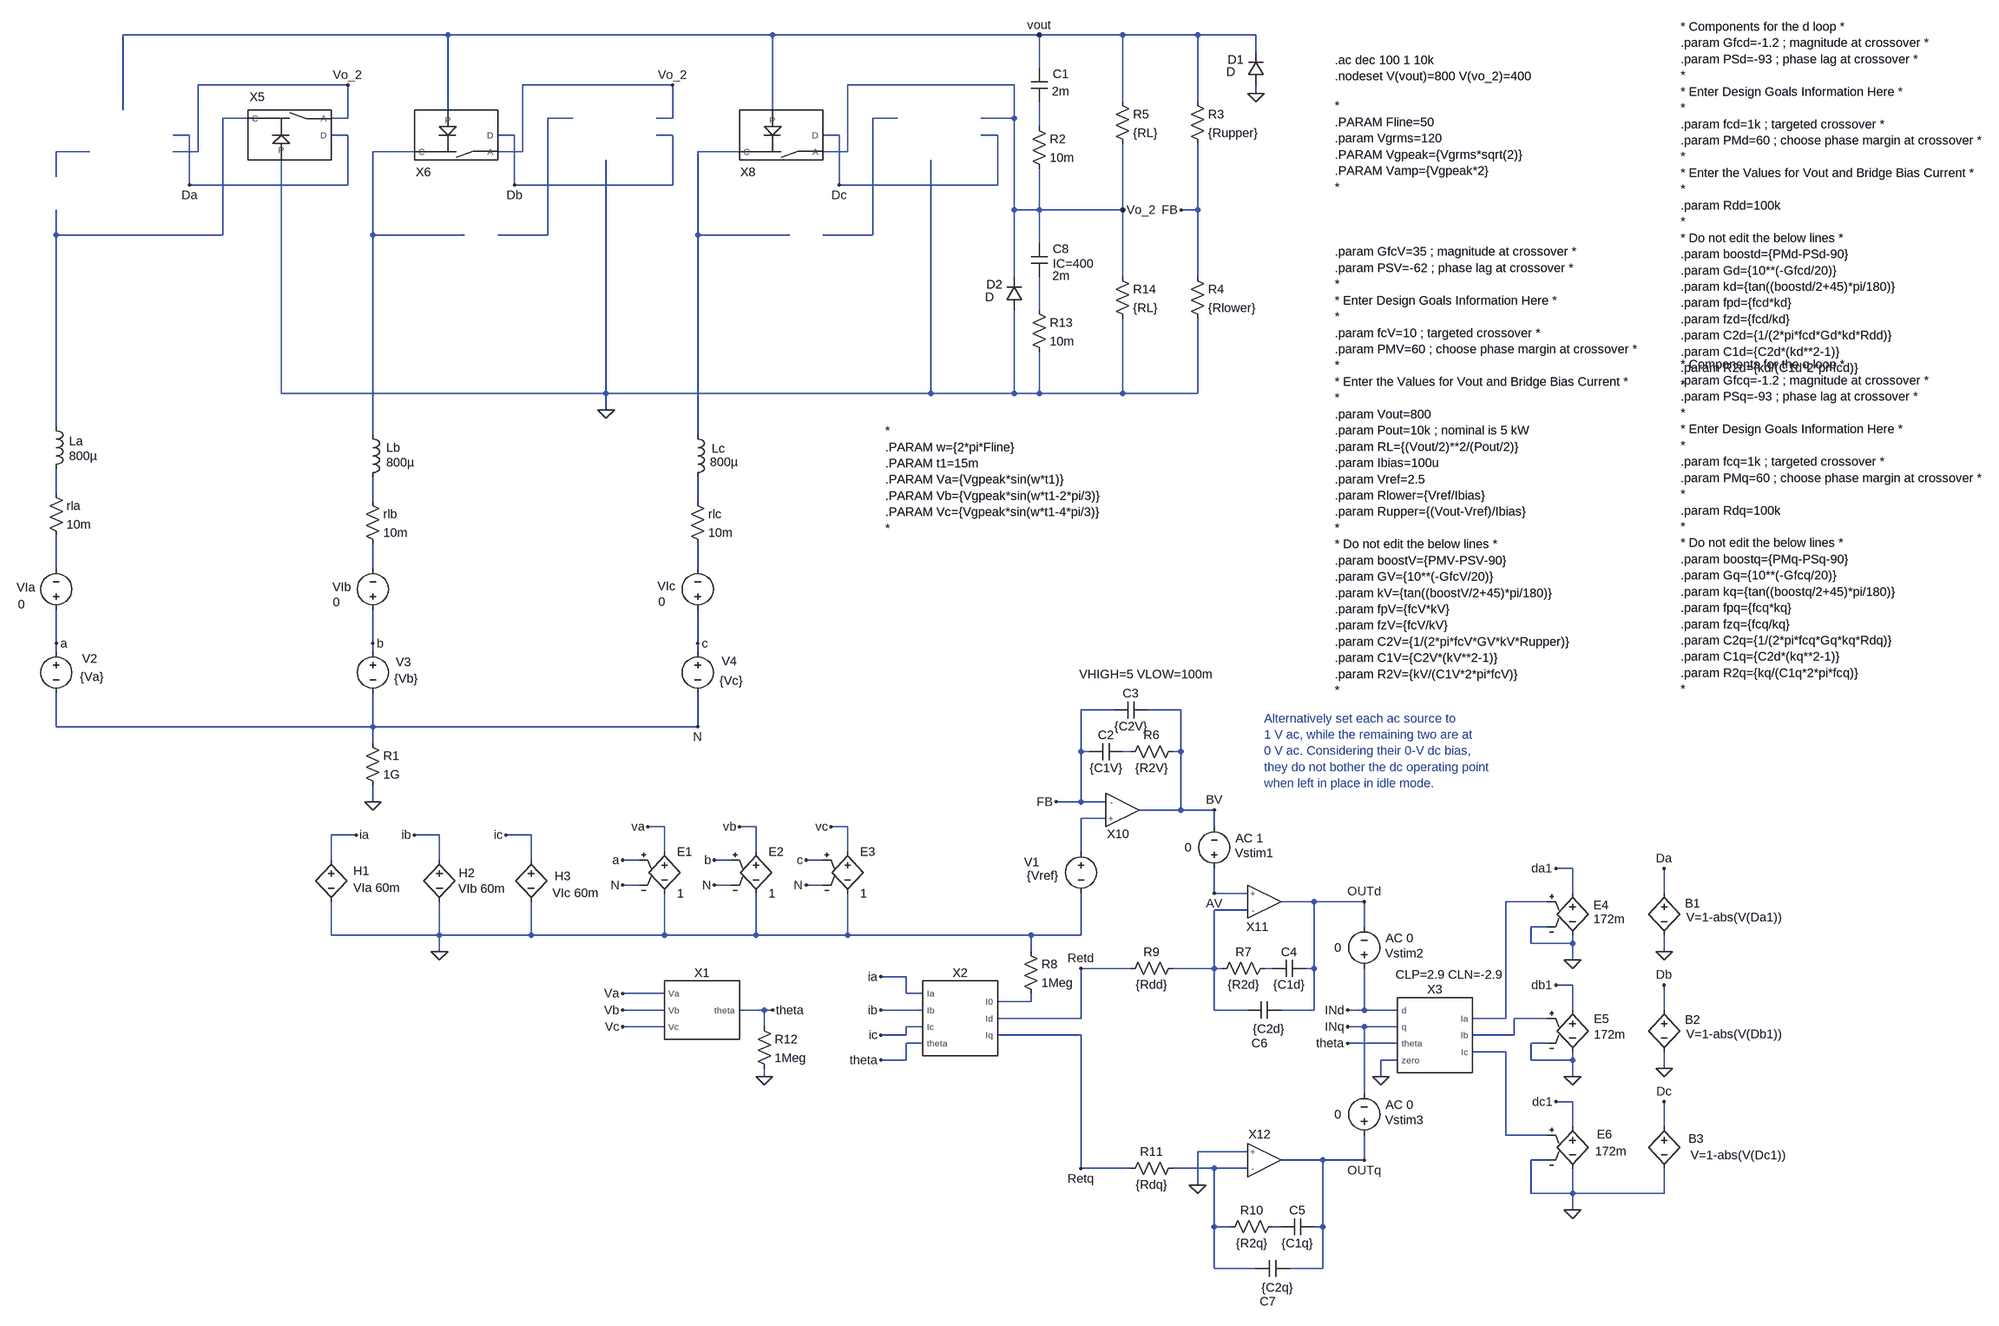
[diagram p0: schematic 3-phase Vienna PFC averaged model - ac response.asc]
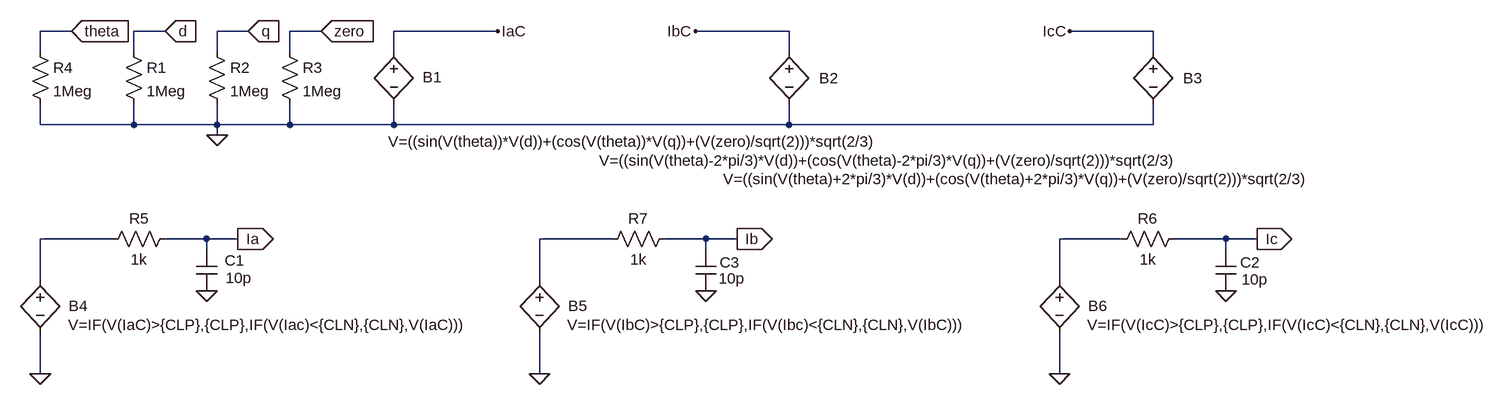
[diagram p1: sub-circuit inverse_dq0.asc]
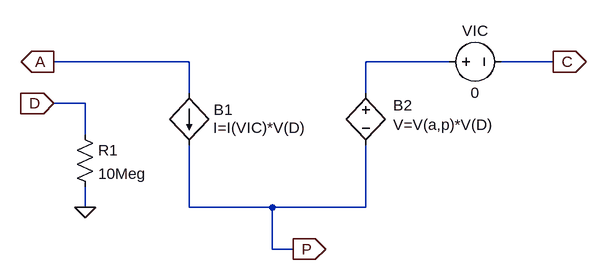
[diagram p2: sub-circuit pwmvm.asc]
3-phase Vienna PFC averaged model - ac response.asc, the LTspice schematic file:
Version 4.1
SHEET 1 4316 1596
WIRE 256 -992 -368 -992
WIRE 880 -992 256 -992
WIRE 1392 -992 880 -992
WIRE 1552 -992 1392 -992
WIRE 1696 -992 1552 -992
WIRE 1808 -992 1696 -992
WIRE 1808 -960 1808 -992
WIRE 1392 -928 1392 -992
WIRE 64 -896 -224 -896
WIRE 688 -896 400 -896
WIRE 1344 -896 1024 -896
WIRE 1808 -880 1808 -896
WIRE 1552 -864 1552 -992
WIRE 1696 -864 1696 -992
WIRE -368 -848 -368 -992
WIRE 256 -848 256 -992
WIRE 880 -848 880 -992
WIRE -128 -832 -176 -832
WIRE 64 -832 64 -896
WIRE 64 -832 32 -832
WIRE 496 -832 448 -832
WIRE 688 -832 688 -896
WIRE 688 -832 656 -832
WIRE 1120 -832 1072 -832
WIRE 1344 -832 1344 -896
WIRE 1344 -832 1280 -832
WIRE 1392 -816 1392 -864
WIRE -240 -800 -272 -800
WIRE 64 -800 32 -800
WIRE 384 -800 352 -800
WIRE 688 -800 656 -800
WIRE 1008 -800 976 -800
WIRE 1312 -800 1280 -800
WIRE -432 -768 -496 -768
WIRE -224 -768 -224 -896
WIRE -224 -768 -272 -768
WIRE 192 -768 112 -768
WIRE 400 -768 400 -896
WIRE 400 -768 352 -768
WIRE 816 -768 736 -768
WIRE 1024 -768 1024 -896
WIRE 1024 -768 976 -768
WIRE -496 -720 -496 -768
WIRE -240 -704 -240 -800
WIRE 64 -704 64 -800
WIRE 64 -704 -240 -704
WIRE 384 -704 384 -800
WIRE 688 -704 688 -800
WIRE 688 -704 384 -704
WIRE 1008 -704 1008 -800
WIRE 1312 -704 1312 -800
WIRE 1312 -704 1008 -704
WIRE 1344 -656 1344 -832
WIRE 1392 -656 1392 -736
WIRE 1392 -656 1344 -656
WIRE 1552 -656 1552 -784
WIRE 1552 -656 1392 -656
WIRE 1696 -656 1696 -784
WIRE 1696 -656 1664 -656
WIRE -496 -608 -496 -656
WIRE -176 -608 -176 -832
WIRE -176 -608 -496 -608
WIRE 112 -608 112 -768
WIRE 288 -608 112 -608
WIRE 448 -608 448 -832
WIRE 448 -608 352 -608
WIRE 736 -608 736 -768
WIRE 912 -608 736 -608
WIRE 1072 -608 1072 -832
WIRE 1072 -608 976 -608
WIRE 1392 -592 1392 -656
WIRE 1344 -528 1344 -656
WIRE 1552 -528 1552 -656
WIRE 1696 -528 1696 -656
WIRE 1392 -464 1392 -528
WIRE -64 -304 -64 -752
WIRE 560 -304 560 -752
WIRE 560 -304 -64 -304
WIRE 1184 -304 1184 -752
WIRE 1184 -304 560 -304
WIRE 1344 -304 1344 -464
WIRE 1344 -304 1184 -304
WIRE 1392 -304 1392 -384
WIRE 1392 -304 1344 -304
WIRE 1552 -304 1552 -448
WIRE 1552 -304 1392 -304
WIRE 1696 -304 1696 -448
WIRE 1696 -304 1552 -304
WIRE 560 -272 560 -304
WIRE -496 -240 -496 -608
WIRE 112 -224 112 -608
WIRE 736 -224 736 -608
WIRE -496 -112 -496 -160
WIRE 112 -96 112 -144
WIRE 736 -96 736 -144
WIRE -496 32 -496 -32
WIRE 112 32 112 -16
WIRE 736 32 736 -16
WIRE -496 176 -496 112
WIRE 112 176 112 112
WIRE 736 176 736 112
WIRE -496 192 -496 176
WIRE 112 192 112 176
WIRE 736 192 736 176
WIRE 1536 304 1472 304
WIRE 1664 304 1600 304
WIRE -496 336 -496 272
WIRE 112 336 112 272
WIRE 112 336 -496 336
WIRE 736 336 736 272
WIRE 736 336 112 336
WIRE 112 368 112 336
WIRE 1472 384 1472 304
WIRE 1488 384 1472 384
WIRE 1568 384 1552 384
WIRE 1664 384 1664 304
WIRE 1664 384 1648 384
WIRE 112 480 112 448
WIRE 1472 480 1472 384
WIRE 1472 480 1424 480
WIRE 1520 480 1472 480
WIRE 1664 496 1664 384
WIRE 1664 496 1584 496
WIRE 1728 496 1664 496
WIRE 1520 512 1472 512
WIRE 672 528 640 528
WIRE 848 528 816 528
WIRE 1024 528 992 528
WIRE 1728 528 1728 496
WIRE 80 544 32 544
WIRE 240 544 192 544
WIRE 416 544 368 544
WIRE 672 576 672 528
WIRE 848 576 848 528
WIRE 1024 576 1024 528
WIRE 1472 576 1472 512
WIRE 32 592 32 544
WIRE 240 592 240 544
WIRE 416 592 416 544
WIRE 624 592 592 592
WIRE 800 592 768 592
WIRE 976 592 944 592
WIRE 2416 608 2384 608
WIRE 624 640 592 640
WIRE 800 640 768 640
WIRE 976 640 944 640
WIRE 1728 656 1728 608
WIRE 1792 656 1728 656
WIRE 2416 656 2416 608
WIRE 2592 656 2592 608
WIRE 1920 672 1856 672
WIRE 2016 672 1920 672
WIRE 2368 672 2288 672
WIRE 1792 688 1728 688
WIRE 2016 720 2016 672
WIRE 2368 720 2336 720
WIRE 32 736 32 672
WIRE 240 736 240 672
WIRE 240 736 32 736
WIRE 416 736 416 672
WIRE 416 736 240 736
WIRE 672 736 672 656
WIRE 672 736 416 736
WIRE 848 736 848 656
WIRE 848 736 672 736
WIRE 1024 736 1024 656
WIRE 1024 736 848 736
WIRE 1376 736 1024 736
WIRE 1472 736 1472 656
WIRE 1472 736 1376 736
WIRE 2336 752 2336 720
WIRE 2416 752 2416 736
WIRE 2416 752 2336 752
WIRE 240 768 240 736
WIRE 1376 768 1376 736
WIRE 2592 768 2592 736
WIRE 2416 784 2416 752
WIRE 1568 800 1472 800
WIRE 1728 800 1728 688
WIRE 1728 800 1648 800
WIRE 1744 800 1728 800
WIRE 1840 800 1824 800
WIRE 1920 800 1920 672
WIRE 1920 800 1904 800
WIRE 1136 816 1088 816
WIRE 2416 832 2384 832
WIRE 672 848 592 848
WIRE 1136 848 1136 816
WIRE 1168 848 1136 848
WIRE 1376 864 1376 848
WIRE 1376 864 1312 864
WIRE 672 880 592 880
WIRE 864 880 816 880
WIRE 880 880 864 880
WIRE 1168 880 1088 880
WIRE 1728 880 1728 800
WIRE 1792 880 1728 880
WIRE 1920 880 1920 800
WIRE 1920 880 1856 880
WIRE 2016 880 2016 800
WIRE 2016 880 1984 880
WIRE 2080 880 2016 880
WIRE 2416 880 2416 832
WIRE 2592 880 2592 832
WIRE 1472 896 1472 800
WIRE 1472 896 1312 896
WIRE 2288 896 2288 672
WIRE 2288 896 2224 896
WIRE 2368 896 2304 896
WIRE 672 912 592 912
WIRE 864 912 864 880
WIRE 1168 912 1136 912
WIRE 2016 912 1984 912
WIRE 2080 912 2016 912
WIRE 1136 928 1136 912
WIRE 1136 928 1088 928
WIRE 1472 928 1312 928
WIRE 2304 928 2304 896
WIRE 2304 928 2224 928
WIRE 1168 944 1136 944
WIRE 2080 944 1984 944
WIRE 2368 944 2336 944
WIRE 2288 960 2224 960
WIRE 1136 976 1136 944
WIRE 1136 976 1088 976
WIRE 2080 976 2048 976
WIRE 2336 976 2336 944
WIRE 2416 976 2416 960
WIRE 2416 976 2336 976
WIRE 2592 992 2592 960
WIRE 864 1008 864 992
WIRE 2048 1008 2048 976
WIRE 2416 1008 2416 976
WIRE 2016 1040 2016 912
WIRE 2416 1056 2384 1056
WIRE 2416 1104 2416 1056
WIRE 2592 1104 2592 1056
WIRE 2288 1120 2288 960
WIRE 2368 1120 2288 1120
WIRE 1792 1152 1696 1152
WIRE 1936 1168 1856 1168
WIRE 2016 1168 2016 1120
WIRE 2016 1168 1936 1168
WIRE 2368 1168 2336 1168
WIRE 1472 1184 1472 928
WIRE 1568 1184 1472 1184
WIRE 1728 1184 1648 1184
WIRE 1792 1184 1728 1184
WIRE 1696 1216 1696 1152
WIRE 2336 1232 2336 1168
WIRE 2416 1232 2416 1184
WIRE 2416 1232 2336 1232
WIRE 2592 1232 2592 1184
WIRE 2592 1232 2416 1232
WIRE 2416 1264 2416 1232
WIRE 1728 1296 1728 1184
WIRE 1760 1296 1728 1296
WIRE 1856 1296 1840 1296
WIRE 1936 1296 1936 1168
WIRE 1936 1296 1920 1296
WIRE 1728 1376 1728 1296
WIRE 1808 1376 1728 1376
WIRE 1936 1376 1936 1296
WIRE 1936 1376 1872 1376
FLAG 112 480 0
FLAG 80 544 ia
FLAG 192 544 ib
FLAG 368 544 ic
FLAG -496 176 a
FLAG 112 176 b
FLAG 736 176 c
FLAG 240 768 0
FLAG 640 528 va
FLAG 736 336 N
FLAG 592 640 N
FLAG 592 592 a
FLAG 816 528 vb
FLAG 768 640 N
FLAG 768 592 b
FLAG 992 528 vc
FLAG 944 640 N
FLAG 944 592 c
FLAG 880 880 theta
FLAG 592 848 Va
FLAG 592 880 Vb
FLAG 592 912 Vc
FLAG 1088 816 ia
FLAG 1088 880 ib
FLAG 1088 928 ic
FLAG 1088 976 theta
FLAG 1424 480 FB
FLAG 1696 1216 0
FLAG 1984 944 theta
FLAG 2048 1008 0
FLAG 864 1008 0
FLAG 2384 608 da1
FLAG 2416 784 0
FLAG 2384 832 db1
FLAG 2416 1008 0
FLAG 2384 1056 dc1
FLAG 2416 1264 0
FLAG -240 -704 Da
FLAG 1664 -656 FB
FLAG 1552 -656 Vo_2
FLAG 64 -896 Vo_2
FLAG 384 -704 Db
FLAG 688 -896 Vo_2
FLAG 1008 -704 Dc
FLAG 1808 -880 0
FLAG 2592 768 0
FLAG 2592 992 0
FLAG 2592 608 Da
FLAG 2592 832 Db
FLAG 2592 1056 Dc
FLAG 560 -272 0
FLAG 1392 -992 vout
FLAG 1472 800 Retd
FLAG 1472 1184 Retq
FLAG 1728 496 BV
FLAG 1728 656 AV
FLAG 2016 672 OUTd
FLAG 2016 1168 OUTq
FLAG 1984 880 INd
FLAG 1984 912 INq
DATAFLAG 1120 -992 ""
DATAFLAG 1424 -656 ""
DATAFLAG 1664 448 ""
DATAFLAG 1920 672 ""
DATAFLAG 1920 1168 ""
DATAFLAG 1440 480 ""
DATAFLAG 656 528 ""
DATAFLAG 832 528 ""
DATAFLAG 1008 528 ""
DATAFLAG -464 -608 ""
DATAFLAG 128 -768 ""
DATAFLAG 768 -768 ""
DATAFLAG -144 -704 ""
DATAFLAG 512 -704 ""
DATAFLAG 1120 -704 ""
DATAFLAG 1472 960 ""
DATAFLAG 1520 800 ""
DATAFLAG 848 880 ""
DATAFLAG 1104 816 ""
DATAFLAG 1104 880 ""
DATAFLAG 1120 976 ""
DATAFLAG 1104 928 ""
SYMBOL res 96 352 R0
SYMATTR InstName R1
SYMATTR Value 1G
SYMBOL res -512 -128 R0
SYMATTR InstName rla
SYMATTR Value 10m
SYMBOL res 96 -112 R0
SYMATTR InstName rlb
SYMATTR Value 10m
SYMBOL res 720 -112 R0
SYMATTR InstName rlc
SYMATTR Value 10m
SYMBOL h 32 576 R0
WINDOW 0 43 37 Left 2
WINDOW 3 43 69 Left 2
SYMATTR InstName H1
SYMATTR Value VIa 60m
SYMBOL h 240 576 R0
WINDOW 0 37 41 Left 2
WINDOW 3 36 71 Left 2
SYMATTR InstName H2
SYMATTR Value VIb 60m
SYMBOL h 416 576 R0
WINDOW 0 45 47 Left 2
WINDOW 3 41 79 Left 2
SYMATTR InstName H3
SYMATTR Value VIc 60m
SYMBOL ind -512 -256 R0
WINDOW 0 41 44 Left 2
WINDOW 3 41 72 Left 2
WINDOW 123 41 100 Left 2
SYMATTR InstName La
SYMATTR Value 800µ
SYMBOL ind 96 -240 R0
WINDOW 0 42 40 Left 2
WINDOW 3 42 69 Left 2
WINDOW 123 42 98 Left 2
SYMATTR InstName Lb
SYMATTR Value 800µ
SYMBOL ind 720 -240 R0
WINDOW 0 43 42 Left 2
WINDOW 3 40 68 Left 2
WINDOW 123 39 96 Left 2
SYMATTR InstName Lc
SYMATTR Value 800µ
SYMBOL voltage -496 128 R180
WINDOW 0 40 59 Left 2
WINDOW 3 60 27 Left 2
WINDOW 123 0 0 Left 0
WINDOW 39 0 0 Left 0
SYMATTR InstName VIa
SYMATTR Value 0
SYMBOL voltage 112 128 R180
WINDOW 0 41 60 Left 2
WINDOW 3 63 31 Left 2
WINDOW 123 0 0 Left 0
WINDOW 39 0 0 Left 0
SYMATTR InstName VIb
SYMATTR Value 0
SYMBOL voltage 736 128 R180
WINDOW 0 43 62 Left 2
WINDOW 3 62 32 Left 2
WINDOW 123 0 0 Left 0
WINDOW 39 0 0 Left 0
SYMATTR InstName VIc
SYMATTR Value 0
SYMBOL e 672 560 R0
SYMATTR InstName E1
SYMATTR Value 1
SYMBOL e 848 560 R0
SYMATTR InstName E2
SYMATTR Value 1
SYMBOL e 1024 560 R0
SYMATTR InstName E3
SYMATTR Value 1
SYMBOL theta_sub 736 880 R0
SYMATTR InstName X1
SYMBOL dq0_sub 1232 896 R0
SYMATTR InstName X2
SYMBOL res 1664 368 R90
WINDOW 0 0 56 VBottom 2
WINDOW 3 32 56 VTop 2
SYMATTR InstName R6
SYMATTR Value {R2V}
SYMBOL cap 1552 368 R90
WINDOW 0 0 32 VBottom 2
WINDOW 3 32 32 VTop 2
WINDOW 123 60 32 VTop 2
SYMATTR InstName C2
SYMATTR Value {C1V}
SYMBOL cap 1600 288 R90
WINDOW 0 0 32 VBottom 2
WINDOW 3 32 32 VTop 2
SYMATTR InstName C3
SYMATTR Value {C2V}
SYMBOL res 1728 816 R270
WINDOW 0 32 56 VTop 2
WINDOW 3 0 56 VBottom 2
SYMATTR InstName R7
SYMATTR Value {R2d}
SYMBOL cap 1840 816 R270
WINDOW 0 32 32 VTop 2
WINDOW 3 0 32 VBottom 2
SYMATTR InstName C4
SYMATTR Value {C1d}
SYMBOL cap 1792 896 R270
WINDOW 0 -63 23 VTop 2
WINDOW 3 -5 41 VBottom 2
SYMATTR InstName C6
SYMATTR Value {C2d}
SYMBOL res 1360 752 R0
SYMATTR InstName R8
SYMATTR Value 1Meg
SYMBOL res 1664 784 R90
WINDOW 0 0 56 VBottom 2
WINDOW 3 32 56 VTop 2
SYMATTR InstName R9
SYMATTR Value {Rdd}
SYMBOL res 1744 1312 R270
WINDOW 0 32 56 VTop 2
WINDOW 3 0 56 VBottom 2
SYMATTR InstName R10
SYMATTR Value {R2q}
SYMBOL cap 1856 1312 R270
WINDOW 0 32 32 VTop 2
WINDOW 3 0 32 VBottom 2
SYMATTR InstName C5
SYMATTR Value {C1q}
SYMBOL cap 1808 1392 R270
WINDOW 0 -63 23 VTop 2
WINDOW 3 -5 41 VBottom 2
SYMATTR InstName C7
SYMATTR Value {C2q}
SYMBOL res 1664 1168 R90
WINDOW 0 0 56 VBottom 2
WINDOW 3 32 56 VTop 2
SYMATTR InstName R11
SYMATTR Value {Rdq}
SYMBOL Inverse_dq0 2144 928 R0
WINDOW 39 35 -100 Bottom 2
SYMATTR SpiceLine CLP=2.9 CLN=-2.9
SYMATTR InstName X3
SYMBOL res 848 896 R0
SYMATTR InstName R12
SYMATTR Value 1Meg
SYMBOL opampTOF 1584 480 R0
WINDOW 0 -40 78 Bottom 2
WINDOW 39 13 -229 Bottom 2
SYMATTR InstName X10
SYMATTR SpiceLine VHIGH=5 VLOW=100m
SYMBOL opampTOF 1856 688 M180
WINDOW 0 -45 -17 Bottom 2
SYMATTR InstName X11
SYMATTR SpiceLine VHIGH=5 VLOW=-5
SYMBOL opampTOF 1856 1184 M180
WINDOW 0 -41 81 Bottom 2
SYMATTR InstName X12
SYMATTR SpiceLine VHIGH=5 VLOW=-5
SYMBOL e 2416 640 R0
WINDOW 0 40 39 Left 2
WINDOW 3 40 65 Left 2
SYMATTR InstName E4
SYMATTR Value 172m
SYMBOL e 2416 864 R0
WINDOW 0 41 33 Left 2
WINDOW 3 41 63 Left 2
SYMATTR InstName E5
SYMATTR Value 172m
SYMBOL e 2416 1088 R0
WINDOW 0 47 31 Left 2
WINDOW 3 44 63 Left 2
SYMATTR InstName E6
SYMATTR Value 172m
SYMBOL diode 1824 -896 R180
WINDOW 0 39 49 Left 2
WINDOW 3 55 25 Left 2
SYMATTR InstName D1
SYMBOL cap 1376 -928 R0
WINDOW 0 42 11 Left 2
WINDOW 3 40 44 Left 2
WINDOW 123 42 70 Left 2
SYMATTR InstName C1
SYMATTR Value 2m
SYMBOL res 1376 -832 R0
SYMATTR InstName R2
SYMATTR Value 10m
SYMBOL res 1680 -880 R0
SYMATTR InstName R3
SYMATTR Value {Rupper}
SYMBOL res 1680 -544 R0
SYMATTR InstName R4
SYMATTR Value {Rlower}
SYMBOL res 1536 -880 R0
SYMATTR InstName R5
SYMATTR Value {RL}
SYMBOL cap 1376 -592 R0
WINDOW 0 42 11 Left 2
WINDOW 3 41 62 Left 2
WINDOW 123 42 39 Left 2
SYMATTR InstName C8
SYMATTR Value 2m
SYMATTR Value2 IC=400
SYMBOL res 1376 -480 R0
SYMATTR InstName R13
SYMATTR Value 10m
SYMBOL res 1536 -544 R0
SYMATTR InstName R14
SYMATTR Value {RL}
SYMBOL PWMVM -32 -816 M0
WINDOW 0 78 -41 Bottom 2
SYMATTR InstName X5
SYMBOL PWMVM 288 -784 R180
WINDOW 0 79 -40 Bottom 2
SYMATTR InstName X6
SYMBOL PWMVM 912 -784 R180
WINDOW 0 79 -40 Bottom 2
SYMATTR InstName X8
SYMBOL bv 2592 640 R0
WINDOW 0 40 35 Left 2
WINDOW 3 43 62 Left 2
SYMATTR InstName B1
SYMATTR Value V=1-abs(V(Da1))
SYMBOL bv 2592 864 R0
WINDOW 0 40 35 Left 2
WINDOW 3 43 62 Left 2
SYMATTR InstName B2
SYMATTR Value V=1-abs(V(Db1))
SYMBOL bv 2592 1088 R0
WINDOW 0 47 39 Left 2
WINDOW 3 51 71 Left 2
SYMATTR InstName B3
SYMATTR Value V=1-abs(V(Dc1))
SYMBOL voltage 1472 560 M0
WINDOW 0 80 36 Left 2
WINDOW 3 43 62 Left 2
WINDOW 123 0 0 Left 0
WINDOW 39 0 0 Left 0
SYMATTR InstName V1
SYMATTR Value {Vref}
SYMBOL voltage -496 176 R0
WINDOW 0 50 29 Left 2
WINDOW 3 46 64 Left 2
SYMATTR InstName V2
SYMATTR Value {Va}
SYMBOL voltage 112 176 R0
WINDOW 0 44 36 Left 2
WINDOW 3 41 68 Left 2
SYMATTR InstName V3
SYMATTR Value {Vb}
SYMBOL voltage 736 176 R0
WINDOW 0 46 34 Left 2
WINDOW 3 42 72 Left 2
SYMATTR InstName V4
SYMATTR Value {Vc}
SYMBOL voltage 1728 624 M180
WINDOW 0 40 45 Left 2
WINDOW 3 -57 56 Left 2
WINDOW 123 41 74 Left 2
WINDOW 39 0 0 Left 0
SYMATTR InstName Vstim1
SYMATTR Value 0
SYMATTR Value2 AC 1
SYMBOL diode 1360 -464 R180
WINDOW 0 39 49 Left 2
WINDOW 3 55 25 Left 2
SYMATTR InstName D2
SYMBOL voltage 2016 816 M180
WINDOW 0 40 45 Left 2
WINDOW 3 -57 56 Left 2
WINDOW 123 41 74 Left 2
WINDOW 39 0 0 Left 0
SYMATTR InstName Vstim2
SYMATTR Value 0
SYMATTR Value2 AC 0
SYMBOL voltage 2016 1136 M180
WINDOW 0 40 45 Left 2
WINDOW 3 -57 56 Left 2
WINDOW 123 41 74 Left 2
WINDOW 39 0 0 Left 0
SYMATTR InstName Vstim3
SYMATTR Value 0
SYMATTR Value2 AC 0
TEXT 1960 -856 Left 2 !*\n.PARAM Fline=50\n.param Vgrms=120\n.PARAM Vgpeak={Vgrms*sqrt(2)}\n.PARAM Vamp={Vgpeak*2}\n*
TEXT 2624 -1008 Left 2 !* Components for the d loop *\n.param Gfcd=-1.2 ; magnitude at crossover *\n.param PSd=-93 ; phase lag at crossover *\n*\n* Enter Design Goals Information Here *\n*\n.param fcd=1k ; targeted crossover *\n.param PMd=60 ; choose phase margin at crossover *\n*\n* Enter the Values for Vout and Bridge Bias Current *\n*\n.param Rdd=100k\n*\n* Do not edit the below lines *\n.param boostd={PMd-PSd-90}\n.param Gd={10**(-Gfcd/20)}\n.param kd={tan((boostd/2+45)*pi/180)}\n.param fpd={fcd*kd}\n.param fzd={fcd/kd}\n.param C2d={1/(2*pi*fcd*Gd*kd*Rdd)}\n.param C1d={C2d*(kd**2-1)}\n.param R2d={kd/(C1d*2*pi*fcd)}\n*
TEXT 2624 -360 Left 2 !* Components for the q loop *\n.param Gfcq=-1.2 ; magnitude at crossover *\n.param PSq=-93 ; phase lag at crossover *\n*\n* Enter Design Goals Information Here *\n*\n.param fcq=1k ; targeted crossover *\n.param PMq=60 ; choose phase margin at crossover *\n*\n.param Rdq=100k\n*\n* Do not edit the below lines *\n.param boostq={PMq-PSq-90}\n.param Gq={10**(-Gfcq/20)}\n.param kq={tan((boostq/2+45)*pi/180)}\n.param fpq={fcq*kq}\n.param fzq={fcq/kq}\n.param C2q={1/(2*pi*fcq*Gq*kq*Rdq)}\n.param C1q={C2d*(kq**2-1)}\n.param R2q={kq/(C1q*2*pi*fcq)}\n*
TEXT 1960 -576 Left 2 !.param GfcV=35 ; magnitude at crossover *\n.param PSV=-62 ; phase lag at crossover *\n*\n* Enter Design Goals Information Here *\n*\n.param fcV=10 ; targeted crossover *\n.param PMV=60 ; choose phase margin at crossover *\n*\n* Enter the Values for Vout and Bridge Bias Current *\n*\n.param Vout=800\n.param Pout=10k ; nominal is 5 kW\n.param RL={(Vout/2)**2/(Pout/2)}\n.param Ibias=100u\n.param Vref=2.5\n.param Rlower={Vref/Ibias}\n.param Rupper={(Vout-Vref)/Ibias}\n*\n* Do not edit the below lines *\n.param boostV={PMV-PSV-90}\n.param GV={10**(-GfcV/20)}\n.param kV={tan((boostV/2+45)*pi/180)}\n.param fpV={fcV*kV}\n.param fzV={fcV/kV}\n.param C2V={1/(2*pi*fcV*GV*kV*Rupper)}\n.param C1V={C2V*(kV**2-1)}\n.param R2V={kV/(C1V*2*pi*fcV)}\n*
TEXT 1096 -232 Left 2 !*\n.PARAM w={2*pi*Fline}\n.PARAM t1=15m\n.PARAM Va={Vgpeak*sin(w*t1)}\n.PARAM Vb={Vgpeak*sin(w*t1-2*pi/3)}\n.PARAM Vc={Vgpeak*sin(w*t1-4*pi/3)}\n*
TEXT 1960 -944 Left 2 !.ac dec 100 1 10k\n.nodeset V(vout)=800 V(vo_2)=400
TEXT 1824 320 Left 2 ;Alternatively set each ac source to\n1 V ac, while the remaining two are at\n0 V ac. Considering their 0-V dc bias,\nthey do not bother the dc operating point\nwhen left in place in idle mode.

inverse_dq0.asc, the sub-circuit schematic file:
Version 4
SHEET 1 1804 980
WIRE -464 16 -512 16
WIRE -320 16 -368 16
WIRE -192 16 -240 16
WIRE -80 16 -128 16
WIRE 192 16 32 16
WIRE 640 16 496 16
WIRE 1200 16 1072 16
WIRE -512 48 -512 16
WIRE -368 48 -368 16
WIRE -240 48 -240 16
WIRE -128 48 -128 16
WIRE 32 48 32 16
WIRE 640 48 640 16
WIRE 1200 48 1200 16
WIRE -512 160 -512 128
WIRE -368 160 -368 128
WIRE -368 160 -512 160
WIRE -240 160 -240 128
WIRE -240 160 -368 160
WIRE -128 160 -128 128
WIRE -128 160 -240 160
WIRE 32 160 32 128
WIRE 32 160 -128 160
WIRE 640 160 640 128
WIRE 640 160 32 160
WIRE 1200 160 1200 128
WIRE 1200 160 640 160
WIRE -240 176 -240 160
WIRE -400 336 -512 336
WIRE -256 336 -320 336
WIRE -208 336 -256 336
WIRE 368 336 256 336
WIRE 512 336 448 336
WIRE 560 336 512 336
WIRE 1152 336 1056 336
WIRE 1312 336 1232 336
WIRE 1360 336 1312 336
WIRE -256 352 -256 336
WIRE 512 352 512 336
WIRE 1312 352 1312 336
WIRE -512 400 -512 336
WIRE 256 400 256 336
WIRE 1056 400 1056 336
WIRE -512 544 -512 480
WIRE 256 544 256 480
WIRE 1056 544 1056 480
FLAG -240 176 0
FLAG -320 16 d
IOPIN -320 16 In
FLAG -192 16 q
IOPIN -192 16 In
FLAG -80 16 zero
IOPIN -80 16 In
FLAG 192 16 IaC
FLAG 496 16 IbC
FLAG 1072 16 IcC
FLAG -464 16 theta
IOPIN -464 16 In
FLAG -208 336 Ia
IOPIN -208 336 Out
FLAG -512 544 0
FLAG 560 336 Ib
IOPIN 560 336 Out
FLAG 256 544 0
FLAG 1360 336 Ic
IOPIN 1360 336 Out
FLAG 1056 544 0
FLAG -256 416 0
FLAG 1312 416 0
FLAG 512 416 0
SYMBOL res -384 32 R0
SYMATTR InstName R1
SYMATTR Value 1Meg
SYMBOL res -256 32 R0
SYMATTR InstName R2
SYMATTR Value 1Meg
SYMBOL res -144 32 R0
SYMATTR InstName R3
SYMATTR Value 1Meg
SYMBOL bv 32 32 R0
WINDOW 0 44 55 Left 2
WINDOW 3 -9 154 Left 2
SYMATTR InstName B1
SYMATTR Value V=((sin(V(theta))*V(d))+(cos(V(theta))*V(q))+(V(zero)/sqrt(2)))*sqrt(2/3)
SYMBOL bv 640 32 R0
WINDOW 0 46 56 Left 2
WINDOW 3 -292 183 Left 2
SYMATTR InstName B2
SYMATTR Value V=((sin(V(theta)-2*pi/3)*V(d))+(cos(V(theta)-2*pi/3)*V(q))+(V(zero)/sqrt(2)))*sqrt(2/3)
SYMBOL res -528 32 R0
SYMATTR InstName R4
SYMATTR Value 1Meg
SYMBOL bv 1200 32 R0
WINDOW 0 46 56 Left 2
WINDOW 3 -661 212 Left 2
SYMATTR InstName B3
SYMATTR Value V=((sin(V(theta)+2*pi/3)*V(d))+(cos(V(theta)+2*pi/3)*V(q))+(V(zero)/sqrt(2)))*sqrt(2/3)
SYMBOL bv -512 384 R0
WINDOW 0 44 55 Left 2
WINDOW 3 43 84 Left 2
SYMATTR InstName B4
SYMATTR Value V=IF(V(IaC)>{CLP},{CLP},IF(V(Iac)<{CLN},{CLN},V(IaC)))
SYMBOL bv 256 384 R0
WINDOW 0 44 55 Left 2
WINDOW 3 43 84 Left 2
SYMATTR InstName B5
SYMATTR Value V=IF(V(IbC)>{CLP},{CLP},IF(V(Ibc)<{CLN},{CLN},V(IbC)))
SYMBOL bv 1056 384 R0
WINDOW 0 44 55 Left 2
WINDOW 3 43 84 Left 2
SYMATTR InstName B6
SYMATTR Value V=IF(V(IcC)>{CLP},{CLP},IF(V(IcC)<{CLN},{CLN},V(IcC)))
SYMBOL res -304 320 R90
WINDOW 0 0 56 VBottom 2
WINDOW 3 32 56 VTop 2
SYMATTR InstName R5
SYMATTR Value 1k
SYMBOL res 1248 320 R90
WINDOW 0 0 56 VBottom 2
WINDOW 3 32 56 VTop 2
SYMATTR InstName R6
SYMATTR Value 1k
SYMBOL res 464 320 R90
WINDOW 0 0 56 VBottom 2
WINDOW 3 32 56 VTop 2
SYMATTR InstName R7
SYMATTR Value 1k
SYMBOL cap -272 352 R0
WINDOW 0 44 17 Left 2
WINDOW 3 45 44 Left 2
SYMATTR InstName C1
SYMATTR Value 10p
SYMBOL cap 1296 352 R0
WINDOW 0 38 20 Left 2
WINDOW 3 40 46 Left 2
SYMATTR InstName C2
SYMATTR Value 10p
SYMBOL cap 496 352 R0
WINDOW 0 37 20 Left 2
WINDOW 3 36 45 Left 2
SYMATTR InstName C3
SYMATTR Value 10p

pwmvm.asc, the sub-circuit schematic file:
Version 4
SHEET 1 880 680
WIRE 64 48 -144 48
WIRE 464 48 336 48
WIRE 624 48 544 48
WIRE 64 96 64 48
WIRE 336 96 336 48
WIRE -96 112 -144 112
WIRE -96 160 -96 112
WIRE -96 272 -96 240
WIRE 64 272 64 176
WIRE 192 272 64 272
WIRE 336 272 336 176
WIRE 336 272 192 272
WIRE 192 336 192 272
WIRE 224 336 192 336
FLAG -96 272 0
FLAG -144 48 A
IOPIN -144 48 Out
FLAG 624 48 C
IOPIN 624 48 Out
FLAG 224 336 P
IOPIN 224 336 Out
FLAG -144 112 D
IOPIN -144 112 In
SYMBOL bi 64 96 R0
WINDOW 0 38 26 Left 2
WINDOW 3 37 53 Left 2
SYMATTR InstName B1
SYMATTR Value I=I(VIC)*V(D)
SYMBOL bv 336 80 R0
WINDOW 0 42 35 Left 2
WINDOW 3 42 65 Left 2
SYMATTR InstName B2
SYMATTR Value V=V(a,p)*V(D)
SYMBOL voltage 448 48 R270
WINDOW 0 32 56 VTop 2
WINDOW 3 -32 56 VBottom 2
WINDOW 123 0 0 Left 0
WINDOW 39 0 0 Left 0
SYMATTR InstName VIC
SYMATTR Value 0
SYMBOL res -112 144 R0
SYMATTR InstName R1
SYMATTR Value 10Meg

The netlist it stands for:
* 3-phase Vienna PFC averaged model - ac response.asc
R1 N 0 1G
rla N009 N012 10m
rlb N010 N013 10m
rlc N011 N014 10m
H1 ia 0 VIa 60m
H2 ib 0 VIb 60m
H3 ic 0 VIc 60m
La N001 N009 800µ
Lb N006 N010 800µ
Lc N007 N011 800µ
VIa a N012 0
VIb b N013 0
VIc c N014 0
E1 va 0 a N 1
E2 vb 0 b N 1
E3 vc 0 c N 1
X§X1 va vb vc theta theta_sub  ; pins Va Vb Vc theta
X§X2 ia ib ic theta N020 Retd Retq dq0_sub  ; pins Ia Ib Ic theta I0 Id Iq
R6 BV N015 {R2V}
C2 N015 FB {C1V}
C3 BV FB {C2V}
R7 N018 N019 {R2d}
C4 N019 OUTd {C1d}
C6 N018 OUTd {C2d}
R8 0 N020 1Meg
R9 N018 Retd {Rdd}
R10 N023 N024 {R2q}
C5 N024 OUTq {C1q}
C7 N023 OUTq {C2q}
R11 N023 Retq {Rdq}
X§X3 INd INq theta 0 N017 N021 N022 inverse_dq0 params: CLP=2.9 CLN=-2.9
R12 theta 0 1Meg
X§X10 FB N016 BV opampTOF params: VHIGH=5 VLOW=100m  ; pins - + OUT
X§X11 N018 AV OUTd opampTOF params: VHIGH=5 VLOW=-5  ; pins - + OUT
X§X12 N023 0 OUTq opampTOF params: VHIGH=5 VLOW=-5  ; pins - + OUT
E4 da1 0 N017 0 172m
E5 db1 0 N021 0 172m
E6 dc1 0 N022 0 172m
D1 0 vout D
C1 vout N004 2m
R2 N004 Vo_2 10m
R3 vout FB {Rupper}
R4 FB 0 {Rlower}
R5 vout Vo_2 {RL}
C8 Vo_2 N008 2m IC=400
R13 N008 0 10m
R14 Vo_2 0 {RL}
X§X5 Da Vo_2 N001 0 pwmvm
X§X6 Db Vo_2 N006 vout pwmvm
X§X8 Dc Vo_2 N007 vout pwmvm
B1 Da 0 V=1-abs(V(Da1))
B2 Db 0 V=1-abs(V(Db1))
B3 Dc 0 V=1-abs(V(Dc1))
V1 N016 0 {Vref}
V2 a N {Va}
V3 b N {Vb}
V4 c N {Vc}
Vstim1 AV BV 0 AC 1
D2 0 Vo_2 D
Vstim2 INd OUTd 0 AC 0
Vstim3 OUTq INq 0 AC 0

* block symbol definitions
.subckt inverse_dq0 d q theta zero Ia Ib Ic
R1 d 0 1Meg
R2 q 0 1Meg
R3 zero 0 1Meg
B1 IaC 0 V=((sin(V(theta))*V(d))+(cos(V(theta))*V(q))+(V(zero)/sqrt(2)))*sqrt(2/3)
B2 IbC 0 V=((sin(V(theta)-2*pi/3)*V(d))+(cos(V(theta)-2*pi/3)*V(q))+(V(zero)/sqrt(2)))*sqrt(2/3)
R4 theta 0 1Meg
B3 IcC 0 V=((sin(V(theta)+2*pi/3)*V(d))+(cos(V(theta)+2*pi/3)*V(q))+(V(zero)/sqrt(2)))*sqrt(2/3)
B4 N001 0 V=IF(V(IaC)>{CLP},{CLP},IF(V(Iac)<{CLN},{CLN},V(IaC)))
B5 N002 0 V=IF(V(IbC)>{CLP},{CLP},IF(V(Ibc)<{CLN},{CLN},V(IbC)))
B6 N003 0 V=IF(V(IcC)>{CLP},{CLP},IF(V(IcC)<{CLN},{CLN},V(IcC)))
R5 Ia N001 1k
R6 Ic N003 1k
R7 Ib N002 1k
C1 Ia 0 10p
C2 Ic 0 10p
C3 Ib 0 10p
.ends inverse_dq0

.subckt pwmvm D A C P
B1 A P I=I(VIC)*V(D)
B2 N001 P V=V(a,p)*V(D)
VIC N001 C 0
R1 D 0 10Meg
.ends pwmvm

.model D D
.lib standard.dio
*
.PARAM Fline=50
.param Vgrms=120
.PARAM Vgpeak={Vgrms*sqrt(2)}
.PARAM Vamp={Vgpeak*2}
*
* Components for the d loop *
.param Gfcd=-1.2 ; magnitude at crossover *
.param PSd=-93 ; phase lag at crossover *
*
* Enter Design Goals Information Here *
*
.param fcd=1k ; targeted crossover *
.param PMd=60 ; choose phase margin at crossover *
*
* Enter the Values for Vout and Bridge Bias Current *
*
.param Rdd=100k
*
* Do not edit the below lines *
.param boostd={PMd-PSd-90}
.param Gd={10**(-Gfcd/20)}
.param kd={tan((boostd/2+45)*pi/180)}
.param fpd={fcd*kd}
.param fzd={fcd/kd}
.param C2d={1/(2*pi*fcd*Gd*kd*Rdd)}
.param C1d={C2d*(kd**2-1)}
.param R2d={kd/(C1d*2*pi*fcd)}
*
* Components for the q loop *
.param Gfcq=-1.2 ; magnitude at crossover *
.param PSq=-93 ; phase lag at crossover *
*
* Enter Design Goals Information Here *
*
.param fcq=1k ; targeted crossover *
.param PMq=60 ; choose phase margin at crossover *
*
.param Rdq=100k
*
* Do not edit the below lines *
.param boostq={PMq-PSq-90}
.param Gq={10**(-Gfcq/20)}
.param kq={tan((boostq/2+45)*pi/180)}
.param fpq={fcq*kq}
.param fzq={fcq/kq}
.param C2q={1/(2*pi*fcq*Gq*kq*Rdq)}
.param C1q={C2d*(kq**2-1)}
.param R2q={kq/(C1q*2*pi*fcq)}
*
.param GfcV=35 ; magnitude at crossover *
.param PSV=-62 ; phase lag at crossover *
*
* Enter Design Goals Information Here *
*
.param fcV=10 ; targeted crossover *
.param PMV=60 ; choose phase margin at crossover *
*
* Enter the Values for Vout and Bridge Bias Current *
*
.param Vout=800
.param Pout=10k ; nominal is 5 kW
.param RL={(Vout/2)**2/(Pout/2)}
.param Ibias=100u
.param Vref=2.5
.param Rlower={Vref/Ibias}
.param Rupper={(Vout-Vref)/Ibias}
*
* Do not edit the below lines *
.param boostV={PMV-PSV-90}
.param GV={10**(-GfcV/20)}
.param kV={tan((boostV/2+45)*pi/180)}
.param fpV={fcV*kV}
.param fzV={fcV/kV}
.param C2V={1/(2*pi*fcV*GV*kV*Rupper)}
.param C1V={C2V*(kV**2-1)}
.param R2V={kV/(C1V*2*pi*fcV)}
*
*
.PARAM w={2*pi*Fline}
.PARAM t1=15m
.PARAM Va={Vgpeak*sin(w*t1)}
.PARAM Vb={Vgpeak*sin(w*t1-2*pi/3)}
.PARAM Vc={Vgpeak*sin(w*t1-4*pi/3)}
*
.ac dec 100 1 10k
.nodeset V(vout)=800 V(vo_2)=400
* Alternatively set each ac source to
* 1 V ac, while the remaining two are at
* 0 V ac. Considering their 0-V dc bias,
* they do not bother the dc operating point
* when left in place in idle mode.
.backanno
.end